# Altium schematic sheet DataBUS.SchDoc
size A0; SheetNumber: 11; SheetTotal: 12
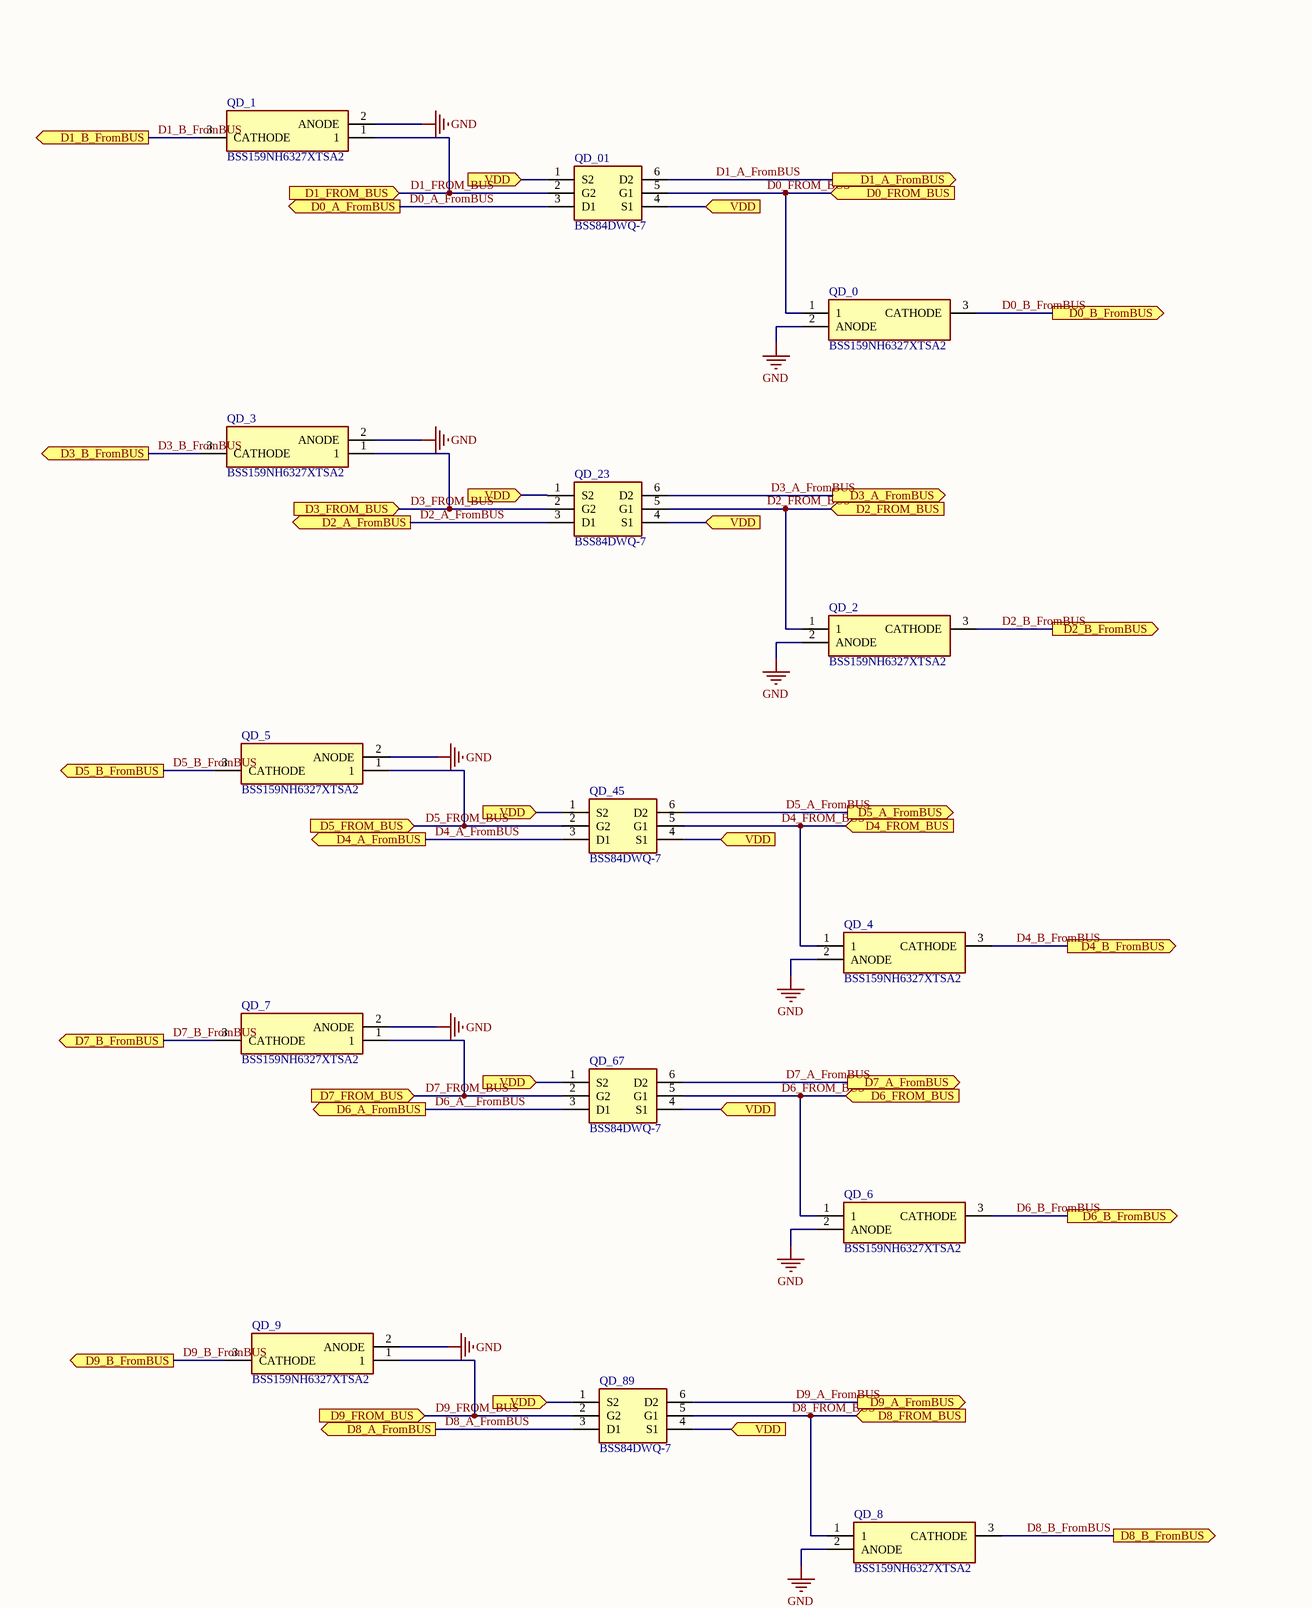
[diagram p0: DataBUS.SchDoc, top left]
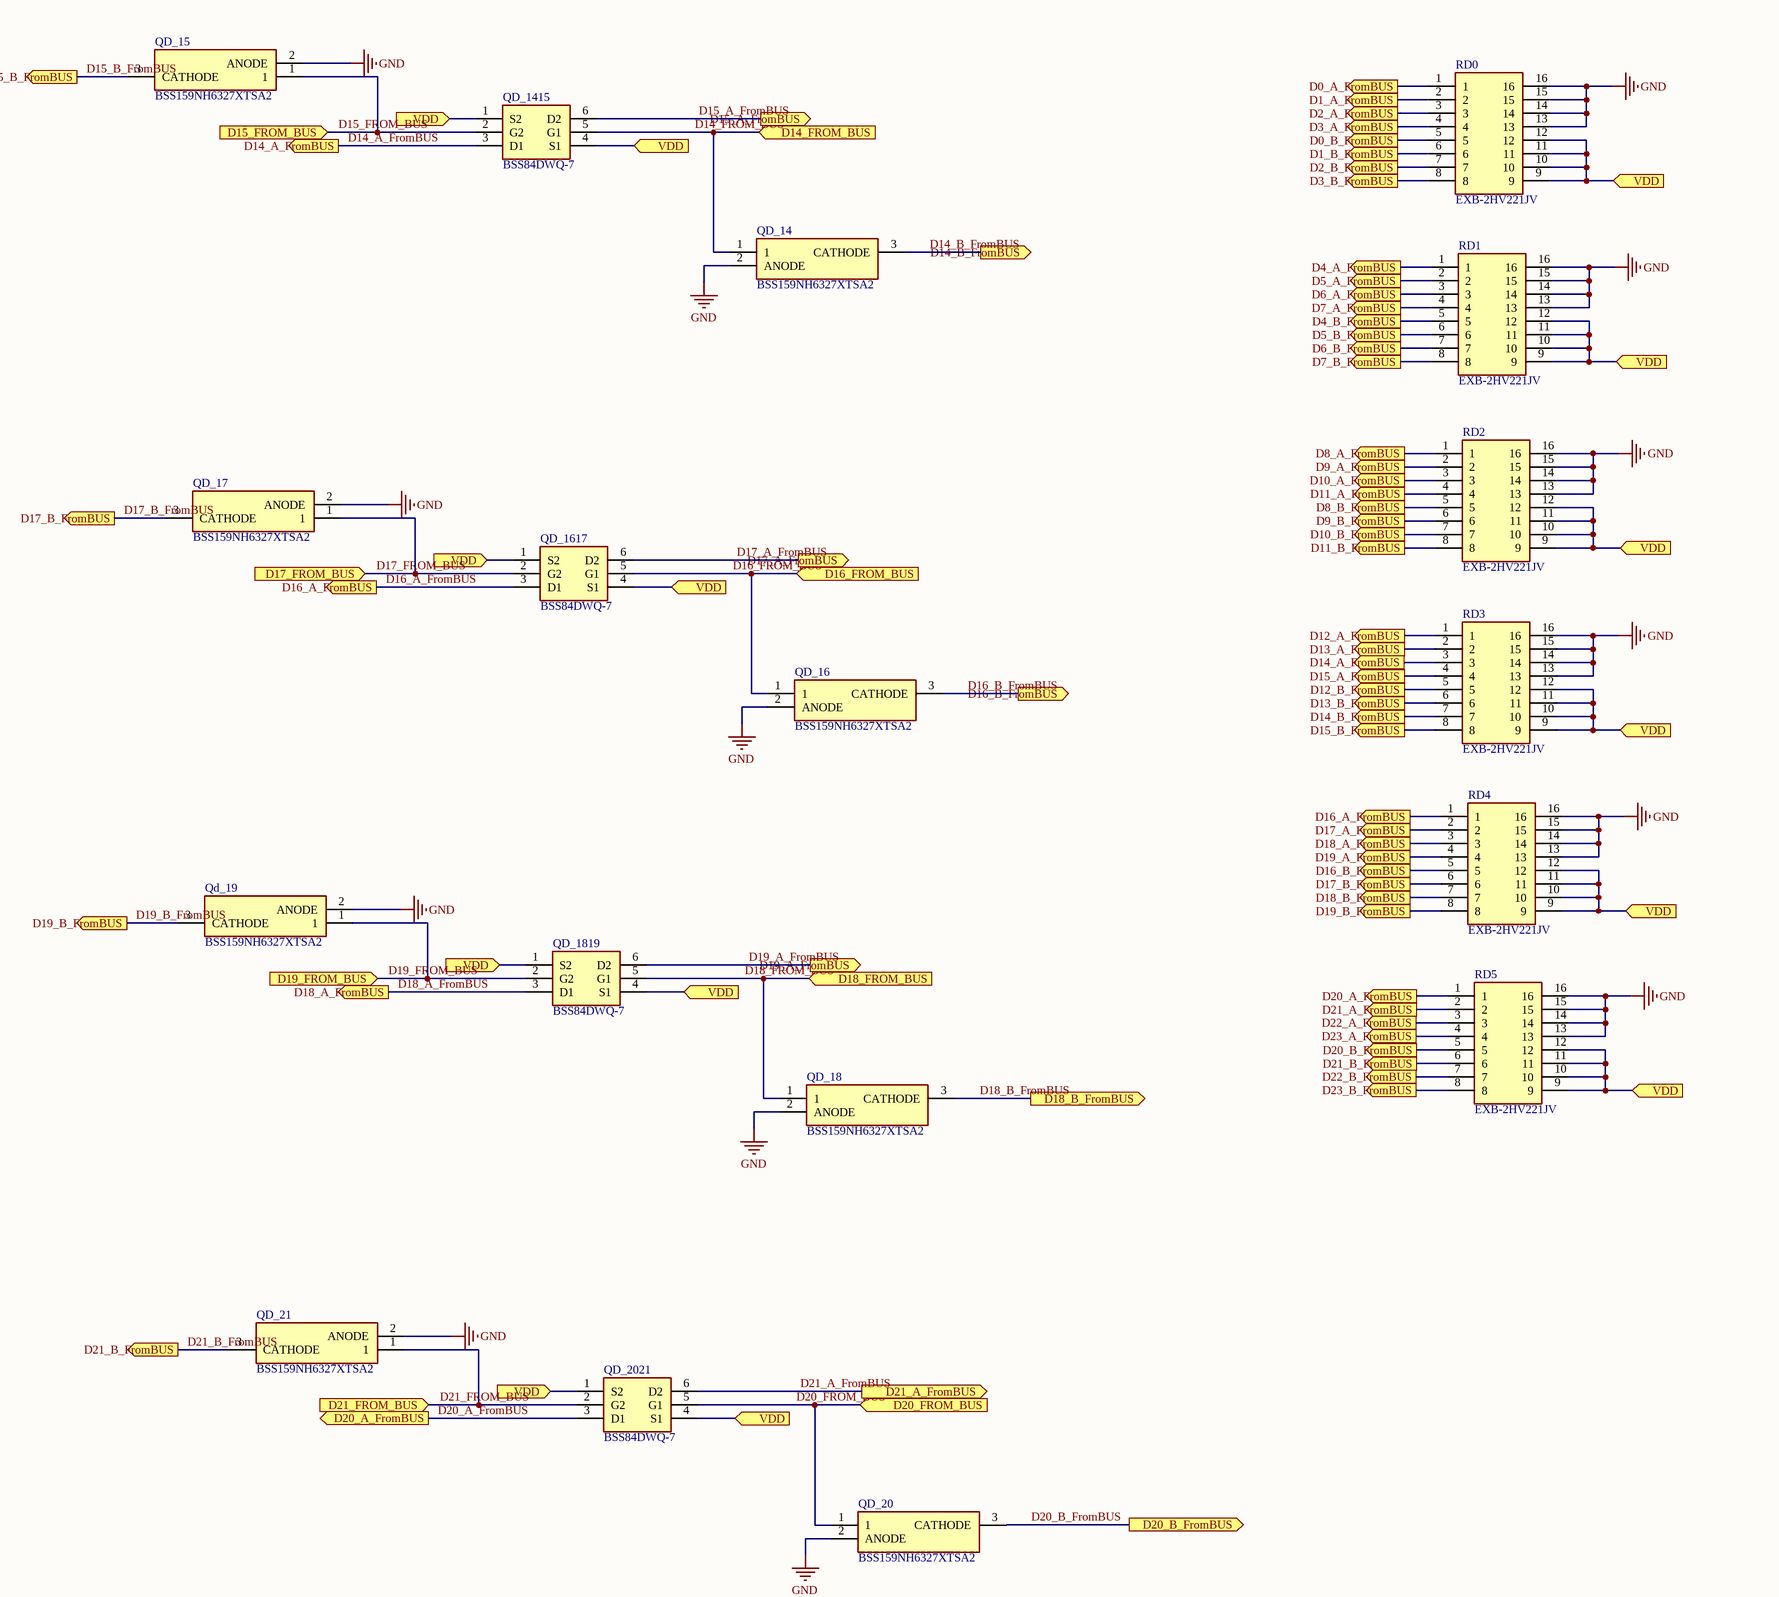
[diagram p1: DataBUS.SchDoc, top middle]
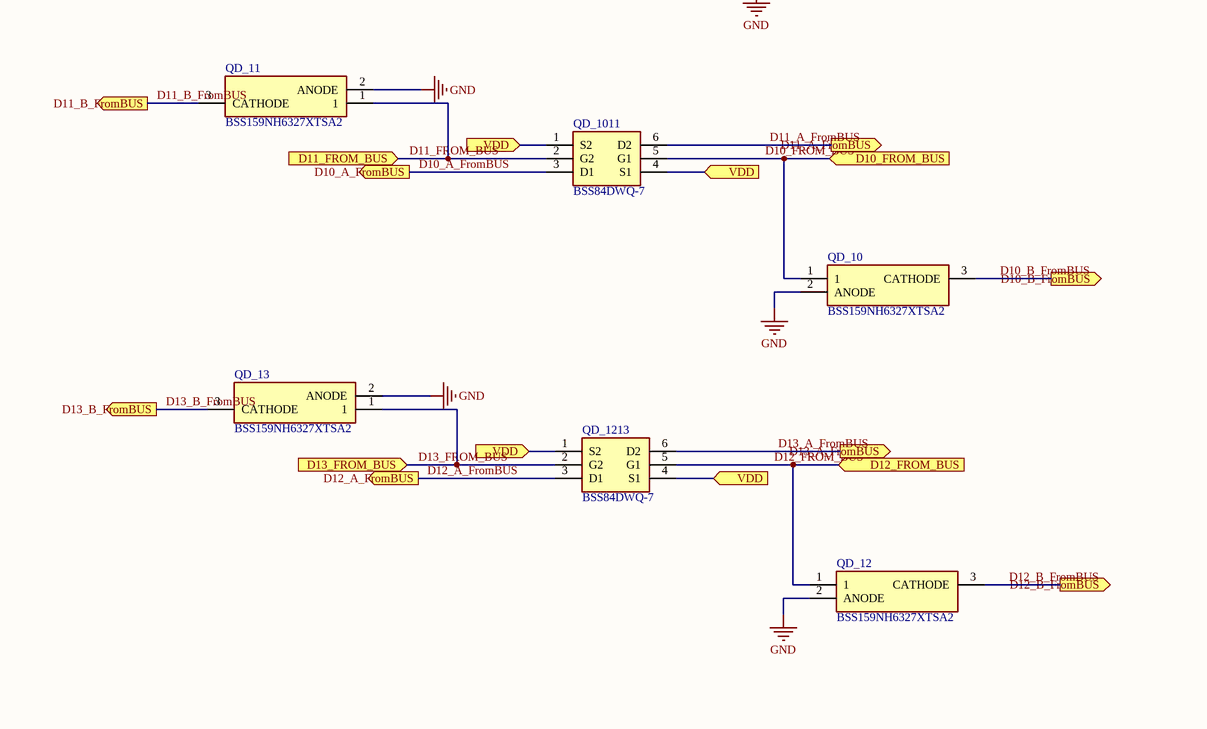
[diagram p2: DataBUS.SchDoc, bottom left]
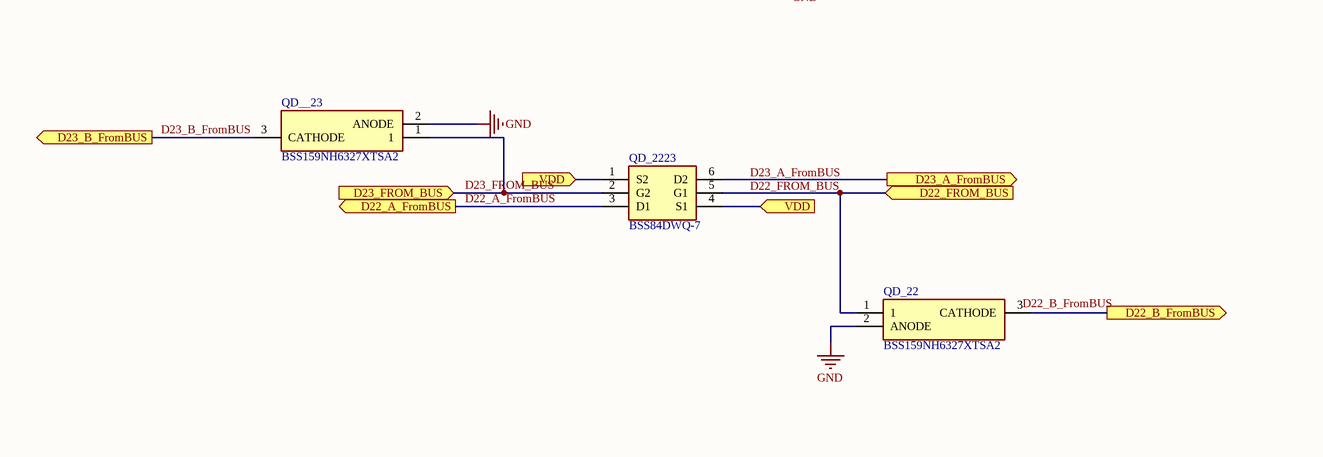
[diagram p3: DataBUS.SchDoc, bottom middle]
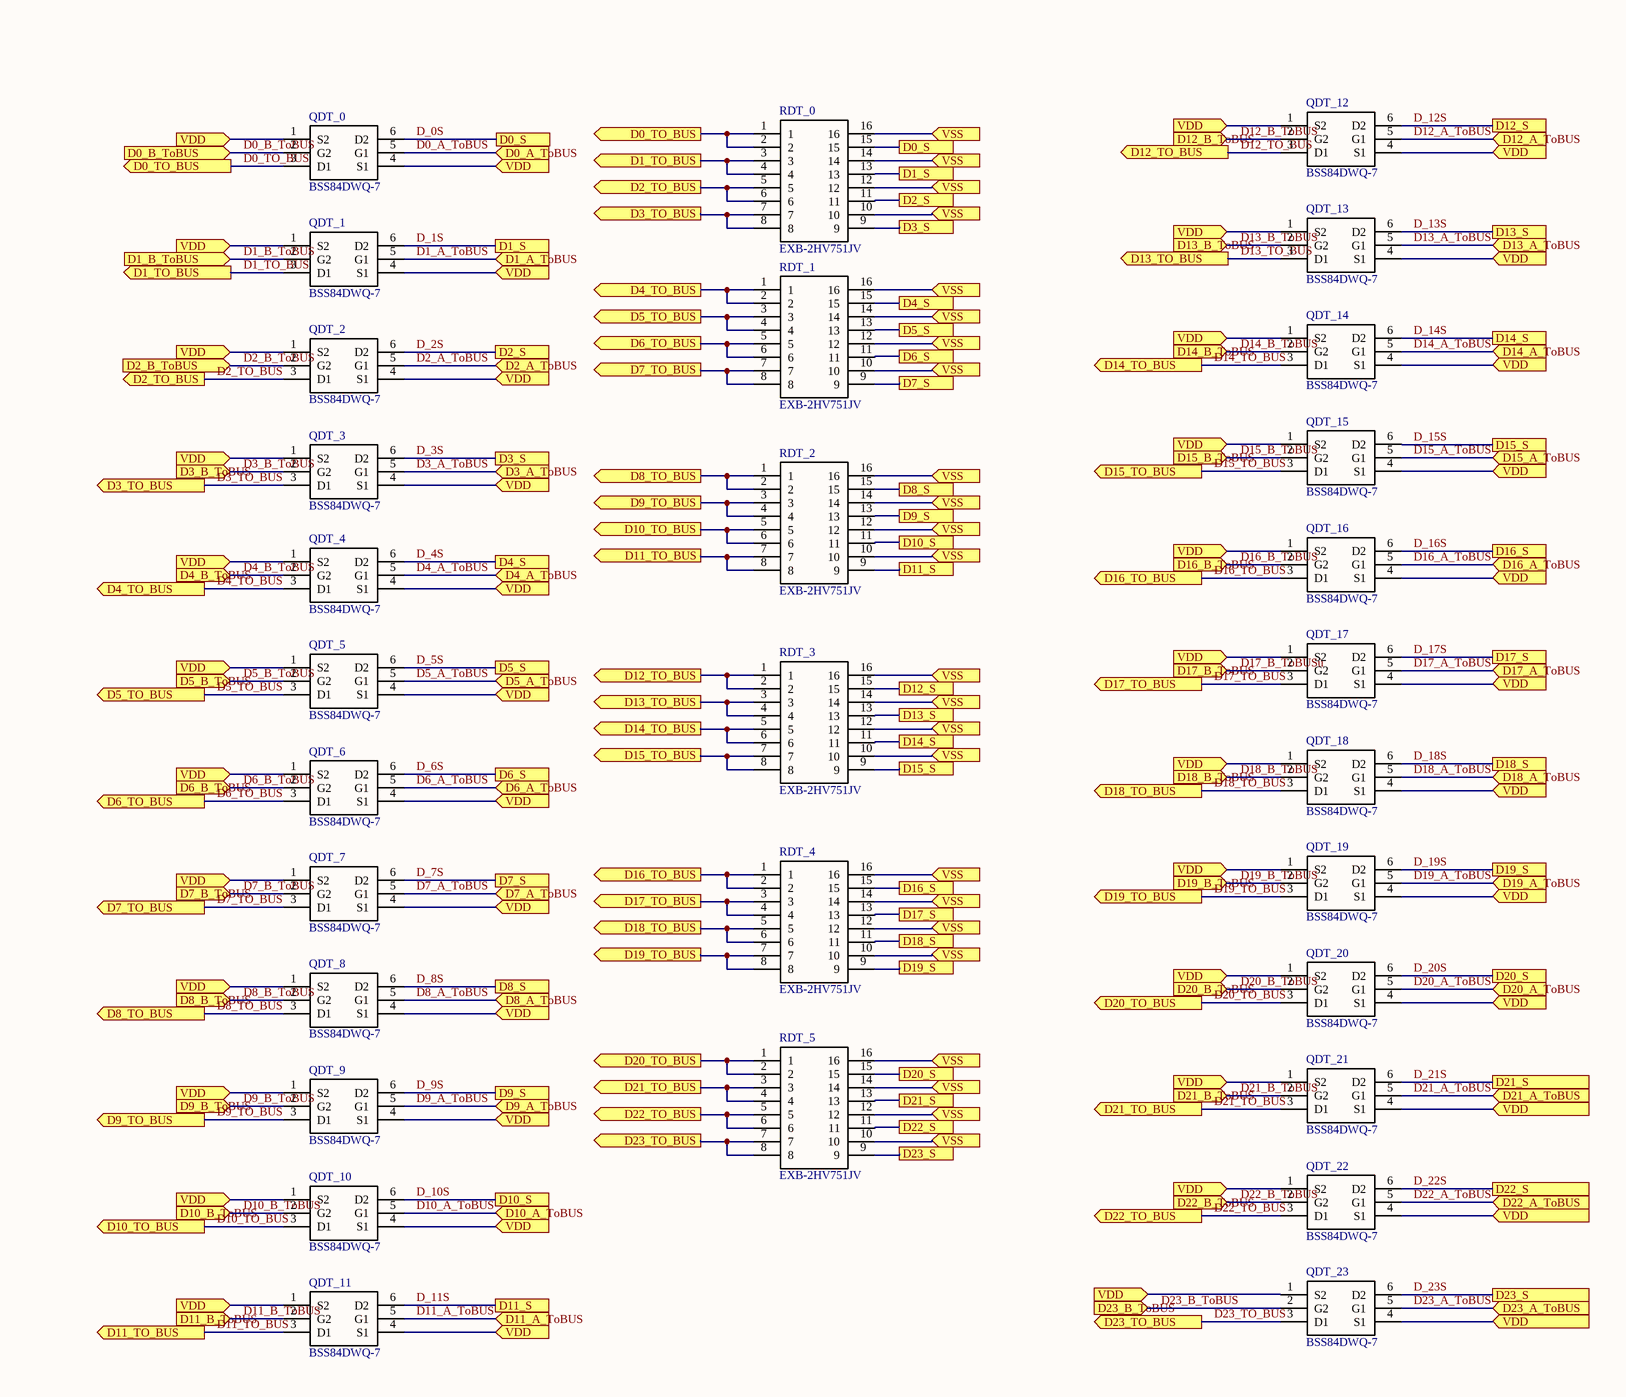
[diagram p4: DataBUS.SchDoc, bottom right]

## Parts
QD_0  BSS159NH6327XTSA2  [SOT95P260X110-3N]
QD_01  BSS84DWQ-7  [SOT65P210X110-6N]
QD_1  BSS159NH6327XTSA2  [SOT95P260X110-3N]
QD_2  BSS159NH6327XTSA2  [SOT95P260X110-3N]
QD_3  BSS159NH6327XTSA2  [SOT95P260X110-3N]
QD_4  BSS159NH6327XTSA2  [SOT95P260X110-3N]
QD_5  BSS159NH6327XTSA2  [SOT95P260X110-3N]
QD_6  BSS159NH6327XTSA2  [SOT95P260X110-3N]
QD_7  BSS159NH6327XTSA2  [SOT95P260X110-3N]
QD_8  BSS159NH6327XTSA2  [SOT95P260X110-3N]
QD_9  BSS159NH6327XTSA2  [SOT95P260X110-3N]
QD_10  BSS159NH6327XTSA2  [SOT95P260X110-3N]
QD_11  BSS159NH6327XTSA2  [SOT95P260X110-3N]
QD_12  BSS159NH6327XTSA2  [SOT95P260X110-3N]
QD_13  BSS159NH6327XTSA2  [SOT95P260X110-3N]
QD_14  BSS159NH6327XTSA2  [SOT95P260X110-3N]
QD_15  BSS159NH6327XTSA2  [SOT95P260X110-3N]
QD_16  BSS159NH6327XTSA2  [SOT95P260X110-3N]
QD_17  BSS159NH6327XTSA2  [SOT95P260X110-3N]
QD_18  BSS159NH6327XTSA2  [SOT95P260X110-3N]
Qd_19  BSS159NH6327XTSA2  [SOT95P260X110-3N]
QD_20  BSS159NH6327XTSA2  [SOT95P260X110-3N]
QD_21  BSS159NH6327XTSA2  [SOT95P260X110-3N]
QD_22  BSS159NH6327XTSA2  [SOT95P260X110-3N]
QD_23  BSS84DWQ-7  [SOT65P210X110-6N]
QD_45  BSS84DWQ-7  [SOT65P210X110-6N]
QD_67  BSS84DWQ-7  [SOT65P210X110-6N]
QD_89  BSS84DWQ-7  [SOT65P210X110-6N]
QD_1011  BSS84DWQ-7  [SOT65P210X110-6N]
QD_1213  BSS84DWQ-7  [SOT65P210X110-6N]
QD_1415  BSS84DWQ-7  [SOT65P210X110-6N]
QD_1617  BSS84DWQ-7  [SOT65P210X110-6N]
QD_1819  BSS84DWQ-7  [SOT65P210X110-6N]
QD_2021  BSS84DWQ-7  [SOT65P210X110-6N]
QD_2223  BSS84DWQ-7  [SOT65P210X110-6N]
QD__23  BSS159NH6327XTSA2  [SOT95P260X110-3N]
QDT_0  BSS84DWQ-7  [SOT65P210X110-6N]
QDT_1  BSS84DWQ-7  [SOT65P210X110-6N]
QDT_2  BSS84DWQ-7  [SOT65P210X110-6N]
QDT_3  BSS84DWQ-7  [SOT65P210X110-6N]
QDT_4  BSS84DWQ-7  [SOT65P210X110-6N]
QDT_5  BSS84DWQ-7  [SOT65P210X110-6N]
QDT_6  BSS84DWQ-7  [SOT65P210X110-6N]
QDT_7  BSS84DWQ-7  [SOT65P210X110-6N]
QDT_8  BSS84DWQ-7  [SOT65P210X110-6N]
QDT_9  BSS84DWQ-7  [SOT65P210X110-6N]
QDT_10  BSS84DWQ-7  [SOT65P210X110-6N]
QDT_11  BSS84DWQ-7  [SOT65P210X110-6N]
QDT_12  BSS84DWQ-7  [SOT65P210X110-6N]
QDT_13  BSS84DWQ-7  [SOT65P210X110-6N]
QDT_14  BSS84DWQ-7  [SOT65P210X110-6N]
QDT_15  BSS84DWQ-7  [SOT65P210X110-6N]
QDT_16  BSS84DWQ-7  [SOT65P210X110-6N]
QDT_17  BSS84DWQ-7  [SOT65P210X110-6N]
QDT_18  BSS84DWQ-7  [SOT65P210X110-6N]
QDT_19  BSS84DWQ-7  [SOT65P210X110-6N]
QDT_20  BSS84DWQ-7  [SOT65P210X110-6N]
QDT_21  BSS84DWQ-7  [SOT65P210X110-6N]
QDT_22  BSS84DWQ-7  [SOT65P210X110-6N]
QDT_23  BSS84DWQ-7  [SOT65P210X110-6N]
RD0  EXB-2HV221JV  [EXB2HV221JV]
RD1  EXB-2HV221JV  [EXB2HV221JV]
RD2  EXB-2HV221JV  [EXB2HV221JV]
RD3  EXB-2HV221JV  [EXB2HV221JV]
RD4  EXB-2HV221JV  [EXB2HV221JV]
RD5  EXB-2HV221JV  [EXB2HV221JV]
RDT_0  EXB-2HV751JV  [EXB2HV221JV]
RDT_1  EXB-2HV751JV  [EXB2HV221JV]
RDT_2  EXB-2HV751JV  [EXB2HV221JV]
RDT_3  EXB-2HV751JV  [EXB2HV221JV]
RDT_4  EXB-2HV751JV  [EXB2HV221JV]
RDT_5  EXB-2HV751JV  [EXB2HV221JV]

## Ports
D0_A_FromBUS (out), D0_A_ToBUS (in), D0_B_FromBUS (out), D0_B_ToBUS (in), D0_FROM_BUS (in), D0_S, D0_TO_BUS (out), D1_A_FromBUS (out), D1_A_ToBUS (in), D1_B_FromBUS (out), D1_B_ToBUS (in), D1_FROM_BUS (in), D1_S, D1_TO_BUS (out), D2_A_FromBUS (out), D2_A_ToBUS (in), D2_B_FromBUS (out), D2_B_ToBUS (in), D2_FROM_BUS (in), D2_S, D2_TO_BUS (out), D3_A_FromBUS (out), D3_A_ToBUS (in), D3_B_FromBUS (out), D3_B_ToBUS (in), D3_FROM_BUS (in), D3_S, D3_TO_BUS (out), D4_A_FromBUS (out), D4_A_ToBUS (in), D4_B_FromBUS (out), D4_B_ToBUS (in), D4_FROM_BUS (in), D4_S, D4_TO_BUS (out), D5_A_FromBUS (out), D5_A_ToBUS (in), D5_B_FromBUS (out), D5_B_ToBUS (in), D5_FROM_BUS (in), D5_S, D5_TO_BUS (out), D6_A_FromBUS (out), D6_A_ToBUS (in), D6_B_FromBUS (out), D6_B_ToBUS (in), D6_FROM_BUS (in), D6_S, D6_TO_BUS (out), D7_A_FromBUS (out), D7_A_ToBUS (in), D7_B_FromBUS (out), D7_B_ToBUS (in), D7_FROM_BUS (in), D7_S, D7_TO_BUS (out), D8_A_FromBUS (out), D8_A_ToBUS (in), D8_B_FromBUS (out), D8_B_ToBUS (in), D8_FROM_BUS (in), D8_S, D8_TO_BUS (out), D9_A_FromBUS (out), D9_A_ToBUS (in), D9_B_FromBUS (out), D9_B_ToBUS (in), D9_FROM_BUS (in), D9_S, D9_TO_BUS (out), D10_A_FromBUS (out), D10_A_ToBUS (in), D10_B_FromBUS (out), D10_B_ToBUS (in), D10_FROM_BUS (in), D10_S, D10_TO_BUS (out), D11_A_FromBUS (out), D11_A_ToBUS (in), D11_B_FromBUS (out), D11_B_ToBUS (in), D11_FROM_BUS (in), D11_S, D11_TO_BUS (out), D12_A_FromBUS (out), D12_A_ToBUS (in), D12_B_FromBUS (out), D12_B_ToBUS (in), D12_FROM_BUS (in), D12_S, D12_TO_BUS (out), D13_A_FromBUS (out), D13_A_ToBUS (in), D13_B_FromBUS (out), D13_B_ToBUS (in), D13_FROM_BUS (in), D13_S, D13_TO_BUS (out), D14_A_FromBUS (out), D14_A_ToBUS (in), D14_B_FromBUS (out), D14_B_ToBUS (in), D14_FROM_BUS (in), D14_S, D14_TO_BUS (out), D15_A_FromBUS (out), D15_A_ToBUS (in), D15_B_FromBUS (out), D15_B_ToBUS (in), D15_FROM_BUS (in), D15_S, D15_TO_BUS (out), D16_A_FromBUS (out), D16_A_ToBUS (in), D16_B_FromBUS (out), D16_B_ToBUS (in), D16_FROM_BUS (in), D16_S, D16_TO_BUS (out), D17_A_FromBUS (out), D17_A_ToBUS (in), D17_B_FromBUS (out), D17_B_ToBUS (in), D17_FROM_BUS (in), D17_S, D17_TO_BUS (out), D18_A_FromBUS (out), D18_A_ToBUS (in), D18_B_FromBUS (out), D18_B_ToBUS (in), D18_FROM_BUS (in), D18_S, D18_TO_BUS (out), D19_A_FromBUS (out), D19_A_ToBUS (in), D19_B_FromBUS (out), D19_B_ToBUS (in), D19_FROM_BUS (in), D19_S, D19_TO_BUS (out), D20_A_FromBUS (out), D20_A_ToBUS (in), D20_B_FromBUS (out), D20_B_ToBUS (in), D20_FROM_BUS (in), D20_S, D20_TO_BUS (out), D21_A_FromBUS (out), D21_A_ToBUS (in), D21_B_FromBUS (out), D21_B_ToBUS (in), D21_FROM_BUS (in), D21_S, D21_TO_BUS (out), D22_A_FromBUS (out), D22_A_ToBUS (in), D22_B_FromBUS (out), D22_B_ToBUS (in), D22_FROM_BUS (in), D22_S, D22_TO_BUS (out), D23_A_FromBUS (out), D23_A_ToBUS (in), D23_B_FromBUS (out), D23_B_ToBUS (in), D23_FROM_BUS (in), D23_S, D23_TO_BUS (out), VDD (in), VSS (in)

## Nets
GND: QD_0.2(ANODE) QD_1.2(ANODE) QD_2.2(ANODE) QD_3.2(ANODE) QD_4.2(ANODE) QD_5.2(ANODE) QD_6.2(ANODE) QD_7.2(ANODE) QD_8.2(ANODE) QD_9.2(ANODE) QD_10.2(ANODE) QD_11.2(ANODE) QD_12.2(ANODE) QD_13.2(ANODE) QD_14.2(ANODE) QD_15.2(ANODE) QD_16.2(ANODE) QD_17.2(ANODE) QD_18.2(ANODE) Qd_19.2(ANODE) QD_20.2(ANODE) QD_21.2(ANODE) QD_22.2(ANODE) QD__23.2(ANODE) RD0.13 RD0.14 RD0.15 RD0.16 RD1.13 RD1.14 RD1.15 RD1.16 RD2.13 RD2.14 RD2.15 RD2.16 RD3.13 RD3.14 RD3.15 RD3.16 RD4.13 RD4.14 RD4.15 RD4.16 RD5.13 RD5.14 RD5.15 RD5.16
D0_A_FromBUS: QD_01.3(D1) RD0.1 ; port D0_A_FromBUS
D0_A_ToBUS: QDT_0.5(G1) ; port D0_A_ToBUS
D0_B_FromBUS: QD_0.3(CATHODE) RD0.5 ; port D0_B_FromBUS
D0_B_ToBUS: QDT_0.2(G2) ; port D0_B_ToBUS
D0_FROM_BUS: QD_0.1 QD_01.5(G1) ; port D0_FROM_BUS
D0_TO_BUS: QDT_0.3(D1) RDT_0.1 RDT_0.2 ; port D0_TO_BUS
D1_A_FromBUS: QD_01.6(D2) RD0.2 ; port D1_A_FromBUS
D1_A_ToBUS: QDT_1.5(G1) ; port D1_A_ToBUS
D1_B_FromBUS: QD_1.3(CATHODE) RD0.6 ; port D1_B_FromBUS
D1_B_ToBUS: QDT_1.2(G2) ; port D1_B_ToBUS
D1_FROM_BUS: QD_1.1 QD_01.2(G2) ; port D1_FROM_BUS
D1_TO_BUS: QDT_1.3(D1) RDT_0.3 RDT_0.4 ; port D1_TO_BUS
D2_A_FromBUS: QD_23.3(D1) RD0.3 ; port D2_A_FromBUS
D2_A_ToBUS: QDT_2.5(G1) ; port D2_A_ToBUS
D2_B_FromBUS: QD_2.3(CATHODE) RD0.7 ; port D2_B_FromBUS
D2_B_ToBUS: QDT_2.2(G2) ; port D2_B_ToBUS
D2_FROM_BUS: QD_2.1 QD_23.5(G1) ; port D2_FROM_BUS
D2_TO_BUS: QDT_2.3(D1) RDT_0.5 RDT_0.6 ; port D2_TO_BUS
D3_A_FromBUS: QD_23.6(D2) RD0.4 ; port D3_A_FromBUS
D3_A_ToBUS: QDT_3.5(G1) ; port D3_A_ToBUS
D3_B_FromBUS: QD_3.3(CATHODE) RD0.8 ; port D3_B_FromBUS
D3_B_ToBUS: QDT_3.2(G2) ; port D3_B_ToBUS
D3_FROM_BUS: QD_3.1 QD_23.2(G2) ; port D3_FROM_BUS
D3_TO_BUS: QDT_3.3(D1) RDT_0.7 RDT_0.8 ; port D3_TO_BUS
D4_A_FromBUS: QD_45.3(D1) RD1.1 ; port D4_A_FromBUS
D4_A_ToBUS: QDT_4.5(G1) ; port D4_A_ToBUS
D4_B_FromBUS: QD_4.3(CATHODE) RD1.5 ; port D4_B_FromBUS
D4_B_ToBUS: QDT_4.2(G2) ; port D4_B_ToBUS
D4_FROM_BUS: QD_4.1 QD_45.5(G1) ; port D4_FROM_BUS
D4_TO_BUS: QDT_4.3(D1) RDT_1.1 RDT_1.2 ; port D4_TO_BUS
D5_A_FromBUS: QD_45.6(D2) RD1.2 ; port D5_A_FromBUS
D5_A_ToBUS: QDT_5.5(G1) ; port D5_A_ToBUS
D5_B_FromBUS: QD_5.3(CATHODE) RD1.6 ; port D5_B_FromBUS
D5_B_ToBUS: QDT_5.2(G2) ; port D5_B_ToBUS
D5_FROM_BUS: QD_5.1 QD_45.2(G2) ; port D5_FROM_BUS
D5_TO_BUS: QDT_5.3(D1) RDT_1.3 RDT_1.4 ; port D5_TO_BUS
D6_A__FromBUS: QD_67.3(D1) RD1.3 ; port D6_A_FromBUS
D6_A_ToBUS: QDT_6.5(G1) ; port D6_A_ToBUS
D6_B_FromBUS: QD_6.3(CATHODE) RD1.7 ; port D6_B_FromBUS
D6_B_ToBUS: QDT_6.2(G2) ; port D6_B_ToBUS
D6_FROM_BUS: QD_6.1 QD_67.5(G1) ; port D6_FROM_BUS
D6_TO_BUS: QDT_6.3(D1) RDT_1.5 RDT_1.6 ; port D6_TO_BUS
D7_A_FromBUS: QD_67.6(D2) RD1.4 ; port D7_A_FromBUS
D7_A_ToBUS: QDT_7.5(G1) ; port D7_A_ToBUS
D7_B_FromBUS: QD_7.3(CATHODE) RD1.8 ; port D7_B_FromBUS
D7_B_ToBUS: QDT_7.2(G2) ; port D7_B_ToBUS
D7_FROM_BUS: QD_7.1 QD_67.2(G2) ; port D7_FROM_BUS
D7_TO_BUS: QDT_7.3(D1) RDT_1.7 RDT_1.8 ; port D7_TO_BUS
D8_A_FromBUS: QD_89.3(D1) RD2.1 ; port D8_A_FromBUS
D8_A_ToBUS: QDT_8.5(G1) ; port D8_A_ToBUS
D8_B_FromBUS: QD_8.3(CATHODE) RD2.5 ; port D8_B_FromBUS
D8_B_ToBUS: QDT_8.2(G2) ; port D8_B_ToBUS
D8_FROM_BUS: QD_8.1 QD_89.5(G1) ; port D8_FROM_BUS
D8_TO_BUS: QDT_8.3(D1) RDT_2.1 RDT_2.2 ; port D8_TO_BUS
D9_A_FromBUS: QD_89.6(D2) RD2.2 ; port D9_A_FromBUS
D9_A_ToBUS: QDT_9.5(G1) ; port D9_A_ToBUS
D9_B_FromBUS: QD_9.3(CATHODE) RD2.6 ; port D9_B_FromBUS
D9_B_ToBUS: QDT_9.2(G2) ; port D9_B_ToBUS
D9_FROM_BUS: QD_9.1 QD_89.2(G2) ; port D9_FROM_BUS
D9_TO_BUS: QDT_9.3(D1) RDT_2.3 RDT_2.4 ; port D9_TO_BUS
D10_A_FromBUS: QD_1011.3(D1) RD2.3 ; port D10_A_FromBUS
D10_A_ToBUS: QDT_10.5(G1) ; port D10_A_ToBUS
D10_B_FromBUS: QD_10.3(CATHODE) RD2.7 ; port D10_B_FromBUS
D10_B_ToBUS: QDT_10.2(G2) ; port D10_B_ToBUS
D10_FROM_BUS: QD_10.1 QD_1011.5(G1) ; port D10_FROM_BUS
D10_TO_BUS: QDT_10.3(D1) RDT_2.5 RDT_2.6 ; port D10_TO_BUS
D11_A_FromBUS: QD_1011.6(D2) RD2.4 ; port D11_A_FromBUS
D11_A_ToBUS: QDT_11.5(G1) ; port D11_A_ToBUS
D11_B_FromBUS: QD_11.3(CATHODE) RD2.8 ; port D11_B_FromBUS
D11_B_ToBUS: QDT_11.2(G2) ; port D11_B_ToBUS
D11_FROM_BUS: QD_11.1 QD_1011.2(G2) ; port D11_FROM_BUS
D11_TO_BUS: QDT_11.3(D1) RDT_2.7 RDT_2.8 ; port D11_TO_BUS
D12_A_FromBUS: QD_1213.3(D1) RD3.1 ; port D12_A_FromBUS
D12_A_ToBUS: QDT_12.5(G1) ; port D12_A_ToBUS
D12_B_FromBUS: QD_12.3(CATHODE) RD3.5 ; port D12_B_FromBUS
D12_B_ToBUS: QDT_12.2(G2) ; port D12_B_ToBUS
D12_FROM_BUS: QD_12.1 QD_1213.5(G1) ; port D12_FROM_BUS
D12_TO_BUS: QDT_12.3(D1) RDT_3.1 RDT_3.2 ; port D12_TO_BUS
D13_A_FromBUS: QD_1213.6(D2) RD3.2 ; port D13_A_FromBUS
D13_A_ToBUS: QDT_13.5(G1) ; port D13_A_ToBUS
D13_B_FromBUS: QD_13.3(CATHODE) RD3.6 ; port D13_B_FromBUS
D13_B_ToBUS: QDT_13.2(G2) ; port D13_B_ToBUS
D13_FROM_BUS: QD_13.1 QD_1213.2(G2) ; port D13_FROM_BUS
D13_TO_BUS: QDT_13.3(D1) RDT_3.3 RDT_3.4 ; port D13_TO_BUS
D14_A_FromBUS: QD_1415.3(D1) RD3.3 ; port D14_A_FromBUS
D14_A_ToBUS: QDT_14.5(G1) ; port D14_A_ToBUS
D14_B_FromBUS: QD_14.3(CATHODE) RD3.7 ; port D14_B_FromBUS
D14_B_ToBUS: QDT_14.2(G2) ; port D14_B_ToBUS
D14_FROM_BUS: QD_14.1 QD_1415.5(G1) ; port D14_FROM_BUS
D14_TO_BUS: QDT_14.3(D1) RDT_3.5 RDT_3.6 ; port D14_TO_BUS
D15_A_FromBUS: QD_1415.6(D2) RD3.4 ; port D15_A_FromBUS
D15_A_ToBUS: QDT_15.5(G1) ; port D15_A_ToBUS
D15_B_FromBUS: QD_15.3(CATHODE) RD3.8 ; port D15_B_FromBUS
D15_B_ToBUS: QDT_15.2(G2) ; port D15_B_ToBUS
D15_FROM_BUS: QD_15.1 QD_1415.2(G2) ; port D15_FROM_BUS
D15_TO_BUS: QDT_15.3(D1) RDT_3.7 RDT_3.8 ; port D15_TO_BUS
D16_A_FromBUS: QD_1617.3(D1) RD4.1 ; port D16_A_FromBUS
D16_A_ToBUS: QDT_16.5(G1) ; port D16_A_ToBUS
D16_B_FromBUS: QD_16.3(CATHODE) RD4.5 ; port D16_B_FromBUS
D16_B_ToBUS: QDT_16.2(G2) ; port D16_B_ToBUS
D16_FROM_BUS: QD_16.1 QD_1617.5(G1) ; port D16_FROM_BUS
D16_TO_BUS: QDT_16.3(D1) RDT_4.1 RDT_4.2 ; port D16_TO_BUS
D17_A_FromBUS: QD_1617.6(D2) RD4.2 ; port D17_A_FromBUS
D17_A_ToBUS: QDT_17.5(G1) ; port D17_A_ToBUS
D17_B_FromBUS: QD_17.3(CATHODE) RD4.6 ; port D17_B_FromBUS
D17_B_ToBUSù: QDT_17.2(G2) ; port D17_B_ToBUS
D17_FROM_BUS: QD_17.1 QD_1617.2(G2) ; port D17_FROM_BUS
D17_TO_BUS: QDT_17.3(D1) RDT_4.3 RDT_4.4 ; port D17_TO_BUS
D18_A_FromBUS: QD_1819.3(D1) RD4.3 ; port D18_A_FromBUS
D18_A_ToBUS: QDT_18.5(G1) ; port D18_A_ToBUS
D18_B_FromBUS: QD_18.3(CATHODE) RD4.7 ; port D18_B_FromBUS
D18_B_ToBUS: QDT_18.2(G2) ; port D18_B_ToBUS
D18_FROM_BUS: QD_18.1 QD_1819.5(G1) ; port D18_FROM_BUS
D18_TO_BUS: QDT_18.3(D1) RDT_4.5 RDT_4.6 ; port D18_TO_BUS
D19_A_FromBUS: QD_1819.6(D2) RD4.4 ; port D19_A_FromBUS
D19_A_ToBUS: QDT_19.5(G1) ; port D19_A_ToBUS
D19_B_FromBUS: Qd_19.3(CATHODE) RD4.8 ; port D19_B_FromBUS
D19_B_ToBUS: QDT_19.2(G2) ; port D19_B_ToBUS
D19_FROM_BUS: Qd_19.1 QD_1819.2(G2) ; port D19_FROM_BUS
D19_TO_BUS: QDT_19.3(D1) RDT_4.7 RDT_4.8 ; port D19_TO_BUS
D20_A_FromBUS: QD_2021.3(D1) RD5.1 ; port D20_A_FromBUS
D20_A_ToBUS: QDT_20.5(G1) ; port D20_A_ToBUS
D20_B_FromBUS: QD_20.3(CATHODE) RD5.5 ; port D20_B_FromBUS
D20_B_ToBUS: QDT_20.2(G2) ; port D20_B_ToBUS
D20_FROM_BUS: QD_20.1 QD_2021.5(G1) ; port D20_FROM_BUS
D20_TO_BUS: QDT_20.3(D1) RDT_5.1 RDT_5.2 ; port D20_TO_BUS
D21_A_FromBUS: QD_2021.6(D2) RD5.2 ; port D21_A_FromBUS
D21_A_ToBUS: QDT_21.5(G1) ; port D21_A_ToBUS
D21_B_FromBUS: QD_21.3(CATHODE) RD5.6 ; port D21_B_FromBUS
D21_B_ToBUS: QDT_21.2(G2) ; port D21_B_ToBUS
D21_FROM_BUS: QD_21.1 QD_2021.2(G2) ; port D21_FROM_BUS
D21_TO_BUS: QDT_21.3(D1) RDT_5.3 RDT_5.4 ; port D21_TO_BUS
D22_A_FromBUS: QD_2223.3(D1) RD5.3 ; port D22_A_FromBUS
D22_A_ToBUS: QDT_22.5(G1) ; port D22_A_ToBUS
D22_B_FromBUS: QD_22.3(CATHODE) RD5.7 ; port D22_B_FromBUS
D22_B_ToBUS: QDT_22.2(G2) ; port D22_B_ToBUS
D22_FROM_BUS: QD_22.1 QD_2223.5(G1) ; port D22_FROM_BUS
D22_TO_BUS: QDT_22.3(D1) RDT_5.5 RDT_5.6 ; port D22_TO_BUS
D23_A_FromBUS: QD_2223.6(D2) RD5.4 ; port D23_A_FromBUS
D23_A_ToBUS: QDT_23.5(G1) ; port D23_A_ToBUS
D23_B_FromBUS: QD__23.3(CATHODE) RD5.8 ; port D23_B_FromBUS
D23_B_ToBUS: QDT_23.2(G2) ; port D23_B_ToBUS
D23_FROM_BUS: QD_2223.2(G2) QD__23.1 ; port D23_FROM_BUS
D23_TO_BUS: QDT_23.3(D1) RDT_5.7 RDT_5.8 ; port D23_TO_BUS
D_0S: QDT_0.6(D2) RDT_0.15 ; port D0_S
D_1S: QDT_1.6(D2) RDT_0.13 ; port D1_S
D_2S: QDT_2.6(D2) RDT_0.11 ; port D2_S
D_3S: QDT_3.6(D2) RDT_0.9 ; port D3_S
D_4S: QDT_4.6(D2) RDT_1.15 ; port D4_S
D_5S: QDT_5.6(D2) RDT_1.13 ; port D5_S
D_6S: QDT_6.6(D2) RDT_1.11 ; port D6_S
D_7S: QDT_7.6(D2) RDT_1.9 ; port D7_S
D_8S: QDT_8.6(D2) RDT_2.15 ; port D8_S
D_9S: QDT_9.6(D2) RDT_2.13 ; port D9_S
D_10S: QDT_10.6(D2) RDT_2.11 ; port D10_S
D_11S: QDT_11.6(D2) RDT_2.9 ; port D11_S
D_12S: QDT_12.6(D2) RDT_3.15 ; port D12_S
D_13S: QDT_13.6(D2) RDT_3.13 ; port D13_S
D_14S: QDT_14.6(D2) RDT_3.11 ; port D14_S
D_15S: QDT_15.6(D2) RDT_3.9 ; port D15_S
D_16S: QDT_16.6(D2) RDT_4.15 ; port D16_S
D_17S: QDT_17.6(D2) RDT_4.13 ; port D17_S
D_18S: QDT_18.6(D2) RDT_4.11 ; port D18_S
D_19S: QDT_19.6(D2) RDT_4.9 ; port D19_S
D_20S: QDT_20.6(D2) RDT_5.15 ; port D20_S
D_21S: QDT_21.6(D2) RDT_5.13 ; port D21_S
D_22S: QDT_22.6(D2) RDT_5.11 ; port D22_S
D_23S: QDT_23.6(D2) RDT_5.9 ; port D23_S
VDD: QD_01.1(S2) QD_01.4(S1) QD_23.1(S2) QD_23.4(S1) QD_45.1(S2) QD_45.4(S1) QD_67.1(S2) QD_67.4(S1) QD_89.1(S2) QD_89.4(S1) QD_1011.1(S2) QD_1011.4(S1) QD_1213.1(S2) QD_1213.4(S1) QD_1415.1(S2) QD_1415.4(S1) QD_1617.1(S2) QD_1617.4(S1) QD_1819.1(S2) QD_1819.4(S1) QD_2021.1(S2) QD_2021.4(S1) QD_2223.1(S2) QD_2223.4(S1) QDT_0.1(S2) QDT_0.4(S1) QDT_1.1(S2) QDT_1.4(S1) QDT_2.1(S2) QDT_2.4(S1) QDT_3.1(S2) QDT_3.4(S1) QDT_4.1(S2) QDT_4.4(S1) QDT_5.1(S2) QDT_5.4(S1) QDT_6.1(S2) QDT_6.4(S1) QDT_7.1(S2) QDT_7.4(S1) QDT_8.1(S2) QDT_8.4(S1) QDT_9.1(S2) QDT_9.4(S1) QDT_10.1(S2) QDT_10.4(S1) QDT_11.1(S2) QDT_11.4(S1) QDT_12.1(S2) QDT_12.4(S1) QDT_13.1(S2) QDT_13.4(S1) QDT_14.1(S2) QDT_14.4(S1) QDT_15.1(S2) QDT_15.4(S1) QDT_16.1(S2) QDT_16.4(S1) QDT_17.1(S2) QDT_17.4(S1) QDT_18.1(S2) QDT_18.4(S1) QDT_19.1(S2) QDT_19.4(S1) QDT_20.1(S2) QDT_20.4(S1) QDT_21.1(S2) QDT_21.4(S1) QDT_22.1(S2) QDT_22.4(S1) QDT_23.1(S2) QDT_23.4(S1) RD0.9 RD0.10 RD0.11 RD0.12 RD1.9 RD1.10 RD1.11 RD1.12 RD2.9 RD2.10 RD2.11 RD2.12 RD3.9 RD3.10 RD3.11 RD3.12 RD4.9 RD4.10 RD4.11 RD4.12 RD5.9 RD5.10 RD5.11 RD5.12 ; port VDD
VSS: RDT_0.10 RDT_0.12 RDT_0.14 RDT_0.16 RDT_1.10 RDT_1.12 RDT_1.14 RDT_1.16 RDT_2.10 RDT_2.12 RDT_2.14 RDT_2.16 RDT_3.10 RDT_3.12 RDT_3.14 RDT_3.16 RDT_4.10 RDT_4.12 RDT_4.14 RDT_4.16 RDT_5.10 RDT_5.12 RDT_5.14 RDT_5.16 ; port VSS

## Notes on the sheet
- Labels drawn without touching a wire or pin: D22_B_FromBUS, D22_FROM_BUS, D23_A_FromBUS

## Library data of the parts
QD_0-QD_18 Qd_19 QD_20-QD_22 QD__23 = BSS159NH6327XTSA2: Transistor; Manufacturer_Name: Infineon; Datasheet Link: http://www.infineon.com/dgdl/Infineon-BSS159N-DS-v02_02-en.pdf?fileId=db3a304330f68606013108d8b2230036; Height: 1.1mm; Manufacturer_Part_Number: BSS159NH6327XTSA2; Mouser Part Number: 726-BSS159NH6327XTSA; Mouser Price/Stock: https://www.mouser.co.uk/ProductDetail/Infineon-Technologies/BSS159NH6327XTSA2?qs=K00xGehIljvJjqRECkxDcQ%3D%3D; Arrow Part Number: BSS159NH6327XTSA2; Arrow Price/Stock: https://www.arrow.com/en/products/bss159nh6327xtsa2/infineon-technologies-ag?region=nac
QD_01 QD_23 QD_45 QD_67 QD_89 QD_1011 QD_1213 QD_1415 QD_1617 QD_1819 QD_2021 QD_2223 QDT_0-QDT_23 = BSS84DWQ-7: Transistor; Manufacturer_Name: Diodes Inc.; Datasheet Link: https://www.diodes.com/assets/Datasheets/BSS84DWQ.pdf; Height: 1.1mm; Manufacturer_Part_Number: BSS84DWQ-7; Mouser Part Number: 621-BSS84DWQ-7; Mouser Price/Stock: https://www.mouser.co.uk/ProductDetail/Diodes-Incorporated/BSS84DWQ-7?qs=W%2FMpXkg%252BdQ4tYNQw8VopWw%3D%3D; Arrow Part Number: BSS84DWQ-7; Arrow Price/Stock: https://www.arrow.com/en/products/bss84dwq-7/diodes-incorporated
RD0-RD5 RDT_0-RDT_5 = EXB-2HV221JV: Resistor Network; Manufacturer_Name: Panasonic; Datasheet Link: https://industrial.panasonic.com/cdbs/www-data/pdf/AOC0000/AOC0000C14.pdf; Height: 0.55mm; Manufacturer_Part_Number: EXB-2HV221JV; Mouser Part Number: 667-EXB-2HV221JV; Mouser Price/Stock: https://www.mouser.co.uk/ProductDetail/Panasonic/EXB-2HV221JV?qs=LZJzOuaToaVYOp9V2U%2F1Gw%3D%3D; Arrow Part Number: EXB-2HV221JV; Arrow Price/Stock: https://www.arrow.com/en/products/exb-2hv221jv/panasonic?region=europe